# Altium schematic sheet 3V3_High_Current.SchDoc
size A4; SheetNumber: 26; SheetTotal: 29; SPICEModelCacheDXEXORCN: <root> / <DocumentId>DXEXORCN</DocumentId> / </root>
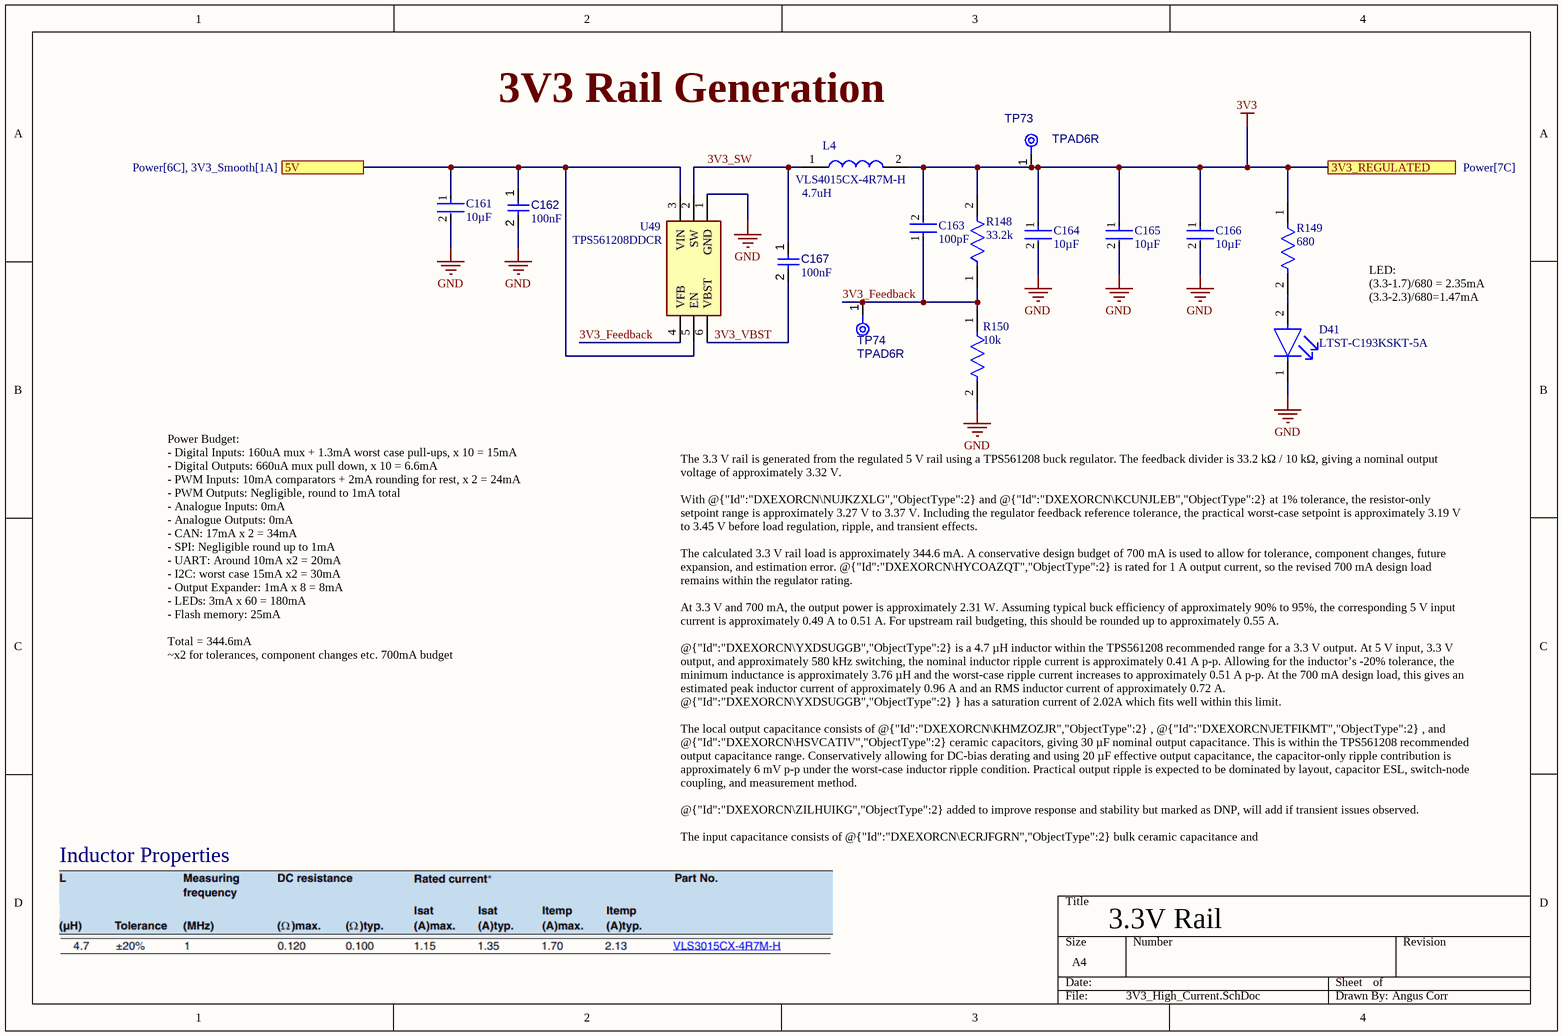
[diagram p0: 3V3_High_Current.SchDoc]

## Parts
C161  value 10µF  [FP-GRM31C-0_2-e0_3_0_8-IPC_C]  (hidden comment: GRM31CR71E106KA12L)
C162  value 100nF  [CAPC1608X90X40NL10T20]  (hidden comment: Capacitor 100 nF +/-10% 50 V 0603)
C163  value 100pF  [FP-C0603C-CF-IPC_B]  (hidden comment: C0603C101F5HACTU)
C164  value 10µF  [FP-GRM31C-0_2-e0_3_0_8-IPC_C]  (hidden comment: GRM31CR71E106KA12L)
C165  value 10µF  [FP-GRM31C-0_2-e0_3_0_8-IPC_C]  (hidden comment: GRM31CR71E106KA12L)
C166  value 10µF  [FP-GRM31C-0_2-e0_3_0_8-IPC_C]  (hidden comment: GRM31CR71E106KA12L)
C167  value 100nF  [CAPC1608X90X40NL10T20]  (hidden comment: Capacitor 100 nF +/-10% 50 V 0603)
D41  LTST-C193KSKT-5A  [FP-LTST-C193KGKT-5A-MFG]
L4  VLS4015CX-4R7M-H  [VLS4015CX100MH]
R148  value 33.2k  [FP-RT0603-IPC_C]  (hidden comment: RT0603BRD0733K2L)
R149  value 680  [FP-CRCW0603-e3-IPC_C]  (hidden comment: CRCW0603680RJNEA)
R150  value 10k  [FP-RT0603-IPC_C]  (hidden comment: RT0603BRD0710KL)
TP73  TPAD6R  [TP06R]  (no BOM)
TP74  TPAD6R  [TP06R]  (no BOM)
U49  TPS561208DDCR  [SOT95P280X110-6N]

## Ports
3V3_REGULATED (see Power[7C]), 5V (see Power[6C], 3V3_Smooth[1A])

## Nets
3V3: C163.2 C164.1 C165.1 C166.1 L4.2 R148.2 R149.1 TP73.1(TP) ; port 3V3_REGULATED
GND: C161.2 C162.2 C164.2 C165.2 C166.2 D41.1(C) R150.2 U49.1(GND)
3V3_Feedback: C163.1 R148.1 R150.1 TP74.1(TP) U49.4(VFB)
3V3_SW: C167.1 L4.1 U49.2(SW)
3V3_VBST: C167.2 U49.6(VBST)
5V: C161.1 C162.1 U49.3(VIN) U49.5(EN) ; port 5V
NetD41_2: D41.2(A) R149.2

## Notes on the sheet
- 3V3 Rail Generation
- (near L4) 4.7uH
- LED:
  (3.3-1.7)/680 = 2.35mA
  (3.3-2.3)/680=1.47mA
- Power Budget:
  - Digital Inputs: 160uA mux + 1.3mA worst case pull-ups, x 10 = 15mA
  - Digital Outputs: 660uA mux pull down, x 10 = 6.6mA
  - PWM Inputs: 10mA comparators + 2mA rounding for rest, x 2 = 24mA
  - PWM Outputs: Negligible, round to 1mA total
  - Analogue Inputs: 0mA
  - Analogue Outputs: 0mA
  - CAN: 17mA x 2 = 34mA
  - SPI: Negligible round up to 1mA
  - UART: Around 10mA x2 = 20mA
  - I2C: worst case 15mA x2 = 30mA
  - Output Expander: 1mA x 8 = 8mA
  - LEDs: 3mA x 60 = 180mA
  - Flash memory: 25mA
  Total = 344.6mA
  ~x2 for tolerances, component changes etc. 700mA budget
- The 3.3 V rail is generated from the regulated 5 V rail using a TPS561208 buck regulator. The feedback divider is 33.2 kΩ / 10 kΩ, giving a nominal output voltage of approximately 3.32 V.
  With @{"Id":"DXEXORCN\NUJKZXLG","ObjectType":2} and @{"Id":"DXEXORCN\KCUNJLEB","ObjectType":2} at 1% tolerance, the resistor-only setpoint range is approximately 3.27 V to 3.37 V. Including the regulator feedback reference tolerance, the practical worst-case setpoint is approximately 3.19 V to 3.45 V before load regulation, ripple, and transient effects.
  The calculated 3.3 V rail load is approximately 344.6 mA. A conservative design budget of 700 mA is used to allow for tolerance, component changes, future expansion, and estimation error. @{"Id":"DXEXORCN\HYCOAZQT","ObjectType":2} is rated for 1 A output current, so the revised 700 mA design load remains within the regulator rating.
  At 3.3 V and 700 mA, the output power is approximately 2.31 W. Assuming typical buck efficiency of approximately 90% to 95%, the corresponding 5 V input current is approximately 0.49 A to 0.51 A. For upstream rail budgeting, this should be rounded up to approximately 0.55 A.
  @{"Id":"DXEXORCN\YXDSUGGB","ObjectType":2} is a 4.7 µH inductor within the TPS561208 recommended range for a 3.3 V output. At 5 V input, 3.3 V output, and approximately 580 kHz switching, the nominal inductor ripple current is approximately 0.41 A p-p. Allowing for the inductor’s -20% tolerance, the minimum inductance is approximately 3.76 µH and the worst-case ripple current increases to approximately 0.51 A p-p. At the 700 mA design load, this gives an estimated peak inductor current of approximately 0.96 A and an RMS inductor current of approximately 0.72 A. @{"Id":"DXEXORCN\YXDSUGGB","ObjectType":2} } has a saturation current of 2.02A which fits well within this limit.
  The local output capacitance consists of @{"Id":"DXEXORCN\KHMZOZJR","ObjectType":2} , @{"Id":"DXEXORCN\JETFIKMT","ObjectType":2} , and @{"Id":"DXEXORCN\HSVCATIV","ObjectType":2} ceramic capacitors, giving 30 µF nominal output capacitance. This is within the TPS561208 recommended output capacitance range. Conservatively allowing for DC-bias derating and using 20 µF effective output capacitance, the capacitor-only ripple contribution is approximately 6 mV p-p under the worst-case inductor ripple condition. Practical output ripple is expected to be dominated by layout, capacitor ESL, switch-node coupling, and measurement method.
  @{"Id":"DXEXORCN\ZILHUIKG","ObjectType":2} added to improve response and stability but marked as DNP, will add if transient issues observed.
  The input capacitance consists of @{"Id":"DXEXORCN\ECRJFGRN","ObjectType":2} bulk ceramic capacitance and @{"Id":"DXEXORCN\CNOYWFMO","ObjectType":2} high-frequency ceramic decoupling. This provides local switching-current decoupling at the regulator input. At the revised 700 mA 3.3 V rail budget, the converter is expected to draw approximately 0.49 A to 0.51 A from the regulated 5 V rail.
- Inductor Properties
- 3.3V Rail
- Angus Corr

## Library data of the parts
C161 C164-C166 = CMP-001-00139-1: 25V 10uF X7R ±10% 1206 Multilayer Ceramic Capacitors MLCC - SMD/SMT ROHS; Manufacturer Lifecycle Status: IN PRODUCTION; Min Operating Temperature: -55°C; Case/Package: 1206; Pins: 2; Voltage Rating: 25V; Max Operating Temperature: 125°C; Tolerance: 10%; Mounting Technology: Surface Mount; Case Code (Imperial): 1206; Case Code (Metric): 3216; China RoHS: Compliant; Depth: 1.6mm; Dielectric Material: Ceramic; Dielectric: X7R; Height: 1.6mm; Lead Free: Lead Free; Length: 3.2mm; Lifecycle Status: Production; Material: Ceramic; Number of Terminals: 2; Packaging: Cut Tape; Radiation Hardening: No; REACH SVHC: Yes; RoHS: Compliant; Schedule B: 8532240020, 8532240020; Termination: SMD/SMT; Thickness: 1.6mm; Voltage Rating (DC): 25V; Voltage: 25V; Width: 1.6mm
C162 C167 = CMP-001-00017-6: Chip Capacitor, 100 nF, +/- 10%, 50 V, 0603 (1608 Metric); Voltage Rating: 50V; Capacitor Type: Ceramic; Tolerance: 10%; Mounting Technology: SM; Max Operating Temperature: 125°C; RoHS Compliant: True; Pins: 2; Case/Package: 0603; Min Operating Temperature: -55°C
C163 = CMP-001-00115-1: Multilayer Ceramic Capacitors MLCC - SMD/SMT 50V 100pF X8R 0603 1%; Temperature Coefficient: 30ppm/°C; Lead Free: Lead Free; Width: 800µm; Schedule B: 8532240020, 8532240020; Introduction Date: 2017-10-02; Harmonized Tariff Schedule (HTS) Code: 8532.24.00.20; Voltage Rating (DC): 50V; Lifecycle Status: Production; Number of Terminals: 2; Height: 800µm; REACH SVHC: Yes; Dielectric Material: Ceramic; Country of Origin: Mexico; Voltage Rating: 50V; Mounting Technology: Surface Mount; Length: 1.6mm; China RoHS: Compliant; RoHS: Compliant; Case/Package: 0603; Max Operating Temperature: 150°C; Export Control Classification Number (ECCN) Code: EAR99; Dielectric: X8R; Material: Ceramic; Min Operating Temperature: -55°C
D41 = CMP-007-00044-1: LED yellow 0603 wavelength 587~594.5nm light intensity 7.1~45mcd Front Mounting; Shape: Rectangular; Power Dissipation: 50mW; Peak Wavelength: 591nm; Number of Circuits: 1; Lens Style: Colorless, Diffused, Rectangular; Test Current: 5mA; Forward Voltage: 2.3V; Lens Transparency: Clear; Lens Color: Clear, Colorless; Viewing Angle: 130°; Forward Current: 30mA; Reverse Voltage: 5V; Luminous Intensity: 26.05mcd; Schedule B: 8541402000, 8541402000; Introduction Date: 2007-04-09; Min Operating Temperature: -55°C; RoHS: Compliant; Terminal Pitch: 1.5mm; Case/Package: 0603; Width: 800µm; Dominant Wavelength: 594.5nm; Pins: 2; Case Code (Imperial): 0603; Height: 350µm; Length: 1.6mm; Color: Yellow; Lead Free: Lead Free; Max Operating Temperature: 85°C; Wavelength: 594.5nm; Harmonized Tariff Schedule (HTS) Code: 8541.40.20.00; China RoHS: Compliant; Illumination Color: Yellow; Number of Terminals: 2; Radiation Hardening: No; Case Code (Metric): 1608; Number of LEDs: 1; Depth: 800µm; Lifecycle Status: Production; REACH SVHC: Yes; Mounting Technology: Surface Mount; Number of Elements: 1
L4 = CMP-006-00029-1: SMD / SMT Inductors (Coils); Manufacturer_Name: TDK; Design Item ID: VLS4015CX-4R7M-H; Manufacturer_Part_Number: VLS4015CX-4R7M-H; Datasheet Link: https://product.tdk.com/system/files/dam/doc/product/inductor/inductor/smd/catalog/inductor_automotive_power_vls4015cx-h_en.pdf; Height: 1.5mm; Source: MAX17643ATC+.SchLib; Mouser Price/Stock: https://www.mouser.co.uk/ProductDetail/TDK/VLS4015CX-4R7M-H?qs=Li%252BoUPsLEnsP0JLzqrKQYg%3D%3D; Mouser Part Number: 810-VLS4015CX-4R7M-H
R148 = CMP-009-00323-1: 100mW Thin Film Resistor 75V ±25ppm/℃ ±0.1% 33.2kΩ 0603 Chip Resistor - Surface Mount ROHS; Temperature Coefficient: 25ppm/°C; Voltage Rating (DC): 50V; Mounting Technology: Surface Mount; Working Voltage: 75V; Length: 1.6mm; Lead Free: Lead Free; REACH SVHC: Yes; Composition: Thin Film; Voltage Rating: 75V; Height: 450µm; Termination: SMD/SMT; Lifecycle Status: Production; Military Standard: Not; Depth: 800µm; Case/Package: 0603; Min Operating Temperature: -55°C; Number of Terminals: 2; Max Power Dissipation: 100mW; China RoHS: Non-Compliant; Number of Terminations: 2; Case Code (Imperial): 0603; Width: 800µm; Max Operating Temperature: 155°C; Tolerance: 0.1%; Power Rating: 100mW; Radiation Hardening: No; RoHS: Compliant; Contact Plating: Tin
R149 = CMP-009-00300-1: Fixed Resistor, Metal Glaze/Thick Film, 0.1W, 680ohm, 75V, 5% +/-Tol, Surface Mount, 0603; Power Rating: 100mW; Temperature Coefficient: 200ppm/°C; Case/Package: 0603; Voltage Rating (DC): 75V; Lifecycle Status: Production; Depth: 850µm; Introduction Date: 2005-02-16; Number of Terminations: 2; Composition: Thick Film; Export Control Classification Number (ECCN) Code: EAR99; RoHS: Compliant; Packaging: Cut Tape; Max Power Dissipation: 100mW; Max Operating Temperature: 155°C; Harmonized Tariff Schedule (HTS) Code: 8533.21.00.30; Voltage Rating: 75V; China RoHS: Non-Compliant; Width: 850µm; Height: 450µm; Schedule B: 8533210045, 8533210045; Mounting Technology: Surface Mount; Pins: 2; Radiation Hardening: No; Features: Automotive AEC-Q200; Min Operating Temperature: -55°C; Lead Free: Lead Free; Working Voltage: 75V; Military Standard: Not; Tolerance: 5%; Case Code (Imperial): 0603; Number of Terminals: 2; Weight: 2.012816mg; REACH SVHC: Yes; Length: 1.55mm; Ratings: AEC-Q200; Contact Plating: Tin; Termination: SMD/SMT; Country of Origin: Israel, Taiwan
R150 = CMP-009-00322-1: Res Thin Film 0603 10K Ohm 0.1% 1/10W |25ppm/|C SMD Paper T/R; Voltage Rating: 75V; Max Power Dissipation: 100mW; Temperature Coefficient: 25ppm/°C; Min Operating Temperature: -55°C; Case/Package: 0603; Mounting Technology: Surface Mount; Max Operating Temperature: 155°C; Tolerance: 0.1%; Case Code (Imperial): 0603; China RoHS: Non-Compliant; Composition: Thin Film; Country of Origin: Mainland China, Taiwan; Depth: 800µm; Export Control Classification Number (ECCN) Code: EAR99; Features: Moisture Resistant; Harmonized Tariff Schedule (HTS) Code: 8533.21.00.30; Height: 450µm; Introduction Date: 2008-06-09; Lead Free: Lead Free; Length: 1.6mm; Lifecycle Status: Production; Military Standard: Not; Number of Terminals: 2; Number of Terminations: 2; Power Rating: 100mW; REACH SVHC: Yes; RoHS: Compliant; Schedule B: 8533210045, 8533210045; Termination: SMD/SMT; Voltage Rating (DC): 75V; Weight: 2.012816mg; Width: 800µm; Working Voltage: 75V
TP73 TP74 = CMP-00028-00002-2: 0.6mm round; Pins: 1
U49 = CMP-033-000001-1: 4.5V to 17V Input; Manufacturer_Name: Texas Instruments; Mouser Part Number: 595-TPS561208DDCR; Arrow Price/Stock: https://www.arrow.com/en/products/tps561208ddcr/texas-instruments?utm_currency=USD&region=nac; Manufacturer_Part_Number: TPS561208DDCR; Design Item ID: TPS561208DDCR; Height: 1.1mm; Datasheet Link: http://www.ti.com/lit/gpn/tps561208; Mouser Price/Stock: https://www.mouser.co.uk/ProductDetail/Texas-Instruments/TPS561208DDCR?qs=5aG0NVq1C4wGRU8Kylr4iw%3D%3D; Source: MAX17643ATC+.SchLib; Arrow Part Number: TPS561208DDCR